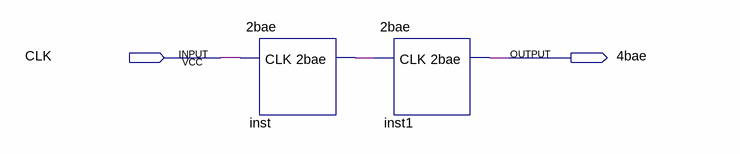
[diagram p0: schematic sheet]
// Quartus schematic 4bae.bdf as structural Verilog: 2 symbols, 2 pins
module \4bae  (
  input  CLK,
  output \4bae 
);

  wire inst_2bae;

  \2bae  inst (.CLK(CLK), .\2bae (inst_2bae));
  \2bae  inst1 (.CLK(inst_2bae), .\2bae (\4bae ));
endmodule
